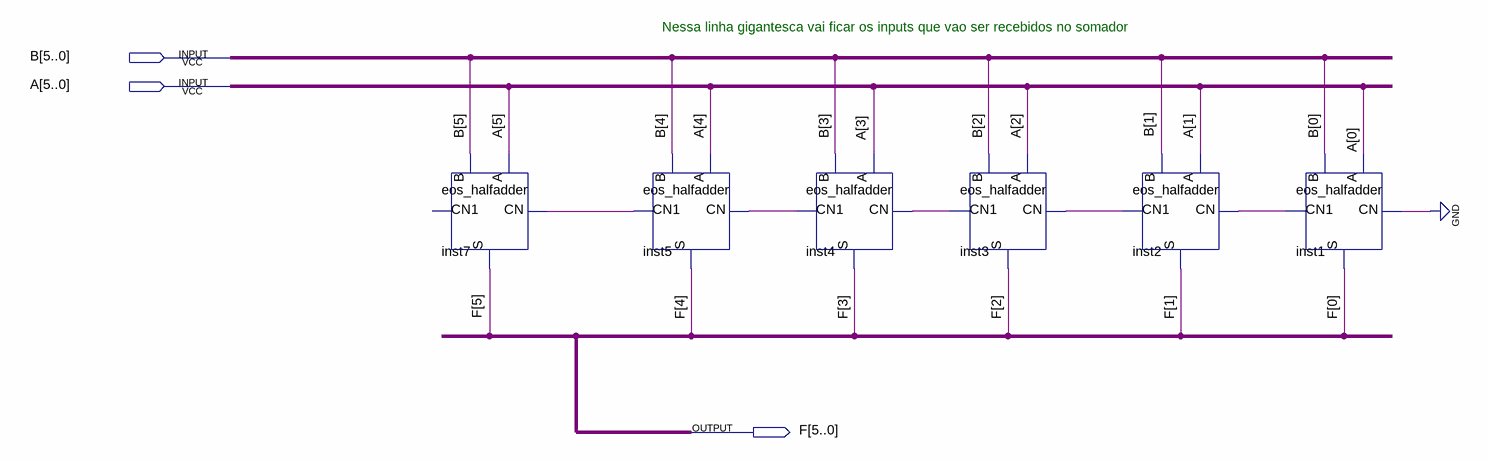
[diagram p0: schematic sheet]
// Quartus schematic eos_somadores.bdf as structural Verilog: 6 symbols, 3 pins
module eos_somadores (
  input  [5:0] B,
  input  [5:0] A,
  output [5:0] F
);

  wire inst1_cn1, inst2_cn1, inst3_cn1, inst4_cn1, inst5_cn1;

  eos_halfadder inst7 (.A(A[5]), .B(B[5]), .CN(inst5_cn1), .S(F[5]));  // open: CN1
  eos_halfadder inst5 (.A(A[4]), .B(B[4]), .CN(inst4_cn1), .CN1(inst5_cn1), .S(F[4]));
  eos_halfadder inst4 (.A(A[3]), .B(B[3]), .CN(inst3_cn1), .CN1(inst4_cn1), .S(F[3]));
  eos_halfadder inst3 (.A(A[2]), .B(B[2]), .CN(inst2_cn1), .CN1(inst3_cn1), .S(F[2]));
  eos_halfadder inst2 (.A(A[1]), .B(B[1]), .CN(inst1_cn1), .CN1(inst2_cn1), .S(F[1]));
  eos_halfadder inst1 (.A(A[0]), .B(B[0]), .CN(1'b0), .CN1(inst1_cn1), .S(F[0]));

  // Notes on the sheet:
  //   Nessa linha gigantesca vai ficar os inputs que vao ser recebidos no somador
endmodule
